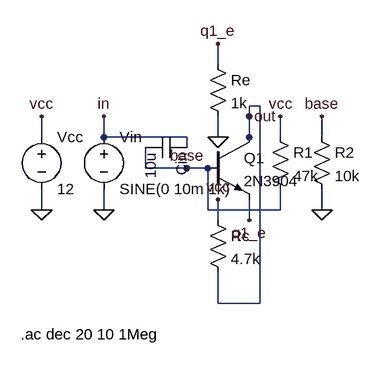
[diagram p0: schematic ce.asc]
ce.asc, the LTspice schematic file:
Version 4
SHEET 1 880 680
WIRE 128 80 128 48
WIRE 128 160 128 192
WIRE 224 80 352 80
WIRE 352 80 352 96
WIRE 224 80 224 48
WIRE 224 160 224 192
WIRE 288 96 288 128
WIRE 288 128 384 128
WIRE 384 128 352 128
WIRE 496 80 496 48
WIRE 496 160 496 192
WIRE 496 192 384 192
WIRE 384 192 384 128
WIRE 560 80 560 48
WIRE 560 160 560 192
WIRE 400 208 400 176
WIRE 400 288 400 336
WIRE 400 336 464 336
WIRE 464 336 464 32
WIRE 464 32 448 32
WIRE 448 32 448 80
WIRE 448 80 448 48
WIRE 448 176 448 208
WIRE 400 -32 400 -64
WIRE 400 48 400 80
FLAG 128 48 vcc
FLAG 128 192 0
FLAG 224 48 in
FLAG 224 192 0
FLAG 352 128 base
FLAG 496 48 vcc
FLAG 560 48 base
FLAG 560 192 0
FLAG 400 176 vcc
FLAG 448 48 out
FLAG 448 208 q1_e
FLAG 400 -64 q1_e
FLAG 400 80 0
SYMBOL voltage 128 64 R0
SYMATTR InstName Vcc
SYMATTR Value 12
SYMBOL voltage 224 64 R0
SYMATTR InstName Vin
SYMATTR Value SINE(0 10m 1k)
SYMATTR Value2 AC 1
SYMBOL cap 352 80 R90
SYMATTR InstName Cin
SYMATTR Value 10u
SYMBOL npn 384 80 R0
SYMATTR InstName Q1
SYMATTR Value 2N3904
SYMBOL res 480 64 R0
SYMATTR InstName R1
SYMATTR Value 47k
SYMBOL res 544 64 R0
SYMATTR InstName R2
SYMATTR Value 10k
SYMBOL res 384 192 R0
SYMATTR InstName Rc
SYMATTR Value 4.7k
SYMBOL res 384 -48 R0
SYMATTR InstName Re
SYMATTR Value 1k
TEXT 96 384 Left 2 !.ac dec 20 10 1Meg

The netlist it stands for:
* ce.asc
Vcc vcc 0 12
Vin in 0 SINE(0 10m 1k) AC 1
Cin in base 10u
Q1 out base q1_e 0 2N3904
R1 vcc base 47k
R2 base 0 10k
Rc vcc out 4.7k
Re q1_e 0 1k
.model NPN NPN
.model PNP PNP
.lib standard.bjt
.ac dec 20 10 1Meg
.backanno
.end